# Altium schematic sheet VTS_demo.SchDoc
size A4
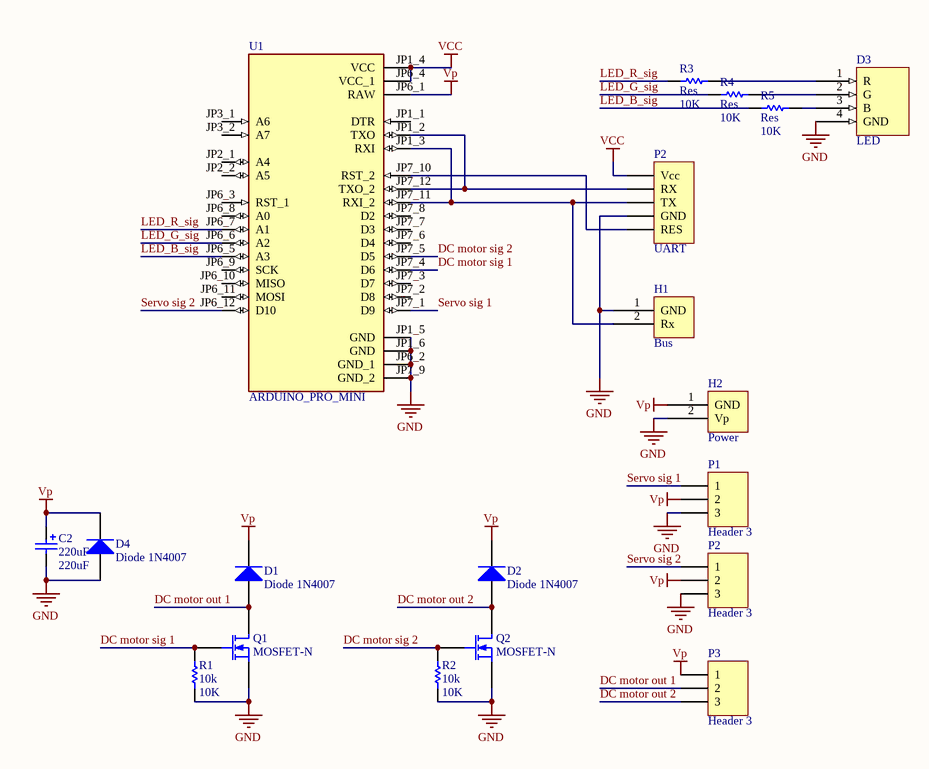
[diagram p0: VTS_demo.SchDoc]

## Parts
(Parts that share a designator on the sheet are numbered #1, #2 ... from top to bottom, then left to right.)
C2  220uF  [CapPol6.3]
D1  Diode 1N4007  [DIOM4326X20N]
D2  Diode 1N4007  [DIOM4326X20N]
D3  LED  [RGB LED]
D4  Diode 1N4007  [DIOM4326X20N]
H1  Bus  [HDR1X2]
H2  Power  [HDR1X2]
P1  Header 3  [HDR1X3]
P2#1  UART  [UART]
P2#2  Header 3  [HDR1X3]
P3  Header 3  [HDR1X3]
Q1  MOSFET-N  [SOT95P245X110-3N]
Q2  MOSFET-N  [SOT95P245X110-3N]
R1  10k  [6-0805_L]
R2  10k  [6-0805_L]
R3  Res  value 10K  [6-0805_L]
R4  Res  value 10K  [6-0805_L]
R5  Res  value 10K  [6-0805_L]
U1  ARDUINO_PRO_MINI  [MODULE_ARDUINO_PRO_MINI]

## Nets
GND: C2.2 D3.4(GND) D4.2(A) H1.1(GND) H2.2(Vp) P1.3 P2#1.4(GND) P2#2.3 Q1.2(S) Q2.2(S) R1.1 R2.1 U1.JP1_5(GND) U1.JP1_6(GND) U1.JP6_2(GND_1) U1.JP7_9(GND_2)
VCC: P2#1.1(Vcc) U1.JP1_4(VCC) U1.JP6_4(VCC_1)
Vp: C2.1 D1.1(K) D2.1(K) D4.1(K) H2.1(GND) P1.2 P2#2.2 P3.1 U1.JP6_1(RAW)
DC motor out 1: D1.2(A) P3.2 Q1.3(D)
DC motor out 2: D2.2(A) P3.3 Q2.3(D)
DC motor sig 1: Q1.1(G) R1.2 U1.JP7_4(D6)
DC motor sig 2: Q2.1(G) R2.2 U1.JP7_5(D5)
LED_B_sig: R5.1 U1.JP6_5(A3)
LED_G_sig: R4.1 U1.JP6_6(A2)
LED_R_sig: R3.1 U1.JP6_7(A1)
Servo sig 1: P1.1 U1.JP7_1(D9)
Servo sig 2: P2#2.1 U1.JP6_12(D10)
NetD3_1: D3.1(R) R3.2
NetD3_2: D3.2(G) R4.2
NetD3_3: D3.3(B) R5.2
NetH1_2: H1.2(Rx) P2#1.3(TX) U1.JP1_3(RXI) U1.JP7_11(RXI_2)
NetP2#1_2: P2#1.2(RX) U1.JP1_2(TXO) U1.JP7_12(TXO_2)
NetP2#1_5: P2#1.5(RES) U1.JP7_10(RST_2)

Not connected (* = marked no-connect by the designer): U1 JP1_1(DTR) JP2_1(A4) JP2_2(A5) JP3_1(A6) JP3_2(A7) JP6_3(RST_1) JP6_8(A0) JP6_9(SCK) JP6_10(MISO) JP6_11(MOSI) JP7_2(D8) JP7_3(D7) JP7_6(D4) JP7_7(D3) JP7_8(D2)

## Library data of the parts
C2 = 220uF Cap: 220uF Polarized Capacitor (Radial); Published: 8-Jun-2000; LatestRevisionDate: 17-Jul-2002; LatestRevisionNote: Re-released for DXP Platform.; PackageReference: RB7.6-15; Publisher: Altium Limited; PackageDescription: Polarized Capacitor (Radial); 2 Leads; Value: 220uF
D1 D2 D4 = Diode 1N4001: 1 Amp General Flyback diode; Published: 8-Jun-2000; LatestRevisionDate: 17-Jul-2002; LatestRevisionNote: Re-released for DXP Platform.; DatasheetVersion: 1998; PackageVersion: Aug-1999; PackageReference: DO-41; Publisher: Altium Limited; PackageDescription: Diode, Axial; Body 5.2 x 2.7 mm (LxDia. max), Lead Dia. 0.86 mm (max); Code_JEDEC: DO-204-AL; ComponentLink1Description: Manufacturer Link; ComponentLink1URL: http://www.fairchildsemi.com/; ComponentLink2Description: Datasheet; ComponentLink2URL: http://www.fairchildsemi.com/ds/1N%2F1N4001.pdf
D3 = RGB LED: pin to pad: 2>4 4>2
P1 P2#2 P3 = Header 3: Header, 3-Pin; LatestRevisionDate: 17-Jul-2002; LatestRevisionNote: Re-released for DXP Platform.; Publisher: Altium Limited
P2#1 = UART: Header, 5-Pin, UART, for uploading; LatestRevisionDate: 17-Jul-2002; LatestRevisionNote: Re-released for DXP Platform.; Publisher: Altium Limited
Q1 Q2 = IRLM2502: N-Channel MOSFET; Published: 8-Jun-2000; LatestRevisionDate: 17-Jul-2002; LatestRevisionNote: Re-released for DXP Platform.; PackageVersion: 1995/1996; PackageReference: E3; Publisher: Altium Limited; PackageDescription: TO, Flat Index; 3 In-Line, Axial Leads; Body Dia. 4.6mm; Lead Dia. 0.5 mm (max)
R1 R2 = 10k res: 10k Resistor; Published: 8-Jun-2000; LatestRevisionDate: 17-Jul-2002; LatestRevisionNote: Re-released for DXP Platform.; PackageReference: AXIAL-0.3; Publisher: Altium Limited; PackageDescription: Axial Device, Thru-Hole; 2 Leads; 0.3 in Pin Spacing; Value: 10K
R3-R5 = res: 10k Resistor; Published: 8-Jun-2000; LatestRevisionDate: 17-Jul-2002; LatestRevisionNote: Re-released for DXP Platform.; PackageReference: AXIAL-0.3; Publisher: Altium Limited; PackageDescription: Axial Device, Thru-Hole; 2 Leads; 0.3 in Pin Spacing
U1 = ARDUINO_PRO_MINI: ATmega328 Arduino Pro Mini 328 5V/16MHz AVRÂ® ATmega AVR MCU 8-Bit Embedded Evaluation Board; pin to pad: JP1_1>JP1_6 JP1_2>JP1_5 JP1_3>JP1_4 JP1_4>JP1_3 JP1_5>JP1_2 JP1_6>JP1_1; Package: None; MP: ARDUINO_PRO_MINI; Value: *; Price: None; Availability: Unavailable